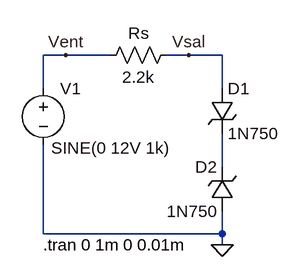
[diagram p0: schematic E3-recortador-nivel.asc]
E3-recortador-nivel.asc, the LTspice schematic file:
Version 4
SHEET 1 880 680
WIRE 160 80 128 80
WIRE 224 80 160 80
WIRE 336 80 304 80
WIRE 384 80 336 80
WIRE 128 128 128 80
WIRE 384 128 384 80
WIRE 384 240 384 192
WIRE 128 336 128 208
WIRE 384 336 384 304
WIRE 384 336 128 336
WIRE 384 352 384 336
FLAG 384 352 0
FLAG 160 80 Vent
FLAG 336 80 Vsal
SYMBOL voltage 128 112 R0
WINDOW 3 11 101 Left 2
WINDOW 123 0 0 Left 0
WINDOW 39 0 0 Left 0
SYMATTR InstName V1
SYMATTR Value SINE(0 12V 1k)
SYMBOL res 320 64 R90
WINDOW 0 0 56 VBottom 2
WINDOW 3 32 56 VTop 2
SYMATTR InstName Rs
SYMATTR Value 2.2k
SYMBOL zener 368 128 R0
SYMATTR InstName D1
SYMATTR Value 1N750
SYMATTR Description Diode
SYMATTR Type diode
SYMBOL zener 400 304 R180
WINDOW 0 24 64 Left 2
WINDOW 3 24 0 Left 2
SYMATTR InstName D2
SYMATTR Value 1N750
SYMATTR Description Diode
SYMATTR Type diode
TEXT 128 352 Left 2 !.tran 0 1m 0 0.01m

The netlist it stands for:
* E3-recortador-nivel.asc
V1 Vent 0 SINE(0 12V 1k)
Rs Vsal Vent 2.2k
D1 Vsal N001 1N750
D2 0 N001 1N750
.model D D
.lib standard.dio
.tran 0 1m 0 0.01m
.backanno
.end

* Results of the author's LTspice run, read from the files saved beside the schematic
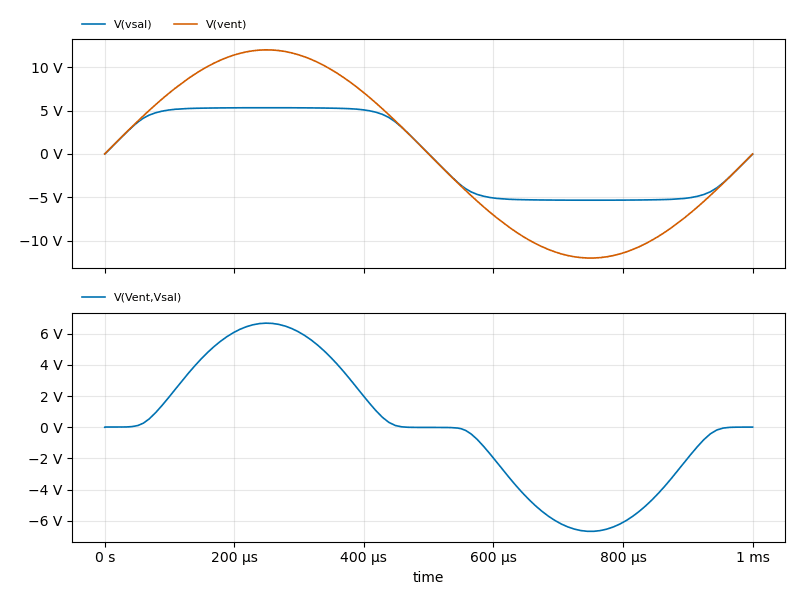
[diagram p1: Transient Analysis of E3-recortador-nivel.asc, plotted from the saved traces]
* Transient Analysis, 1 run:
*   V(vsal): min -5.328 V, max 5.329 V, average -145 µV, rms 4.671 V, last -10.86 mV
*   V(vent): min -11.99 V, max 12 V, average 156 µV, rms 8.485 V, last 0 V
*   V(Vent,Vsal): min -6.666 V, max 6.671 V, average 301 µV, rms 4.072 V, last 10.86 mV